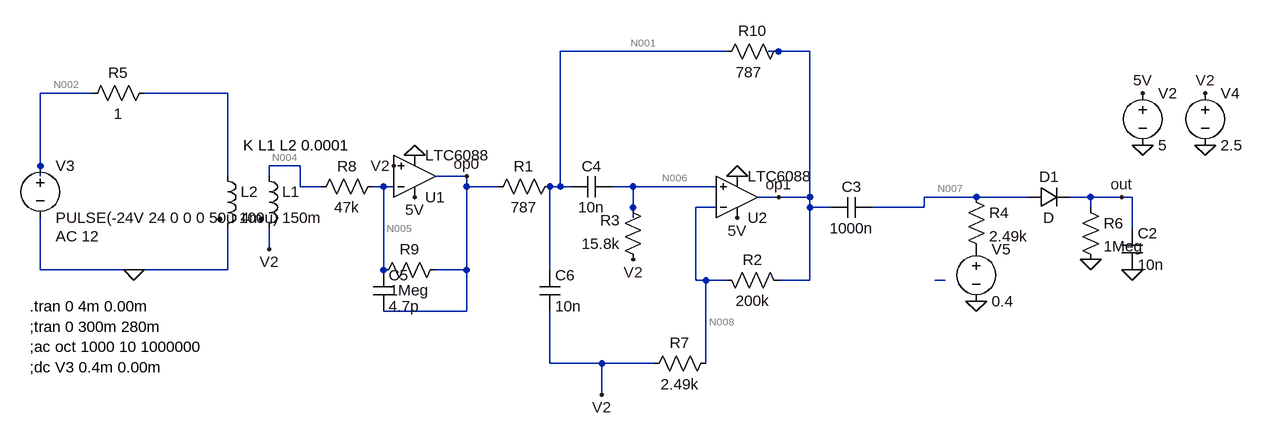
[diagram p0: schematic pw_ti.asc]
* pw_ti.asc
L1 N004 V2 150m
R1 N001 op0 787
V3 N002 0 PULSE(-24V 24 0 0 0 50u 100u) AC 12
R2 op1 N008 200k
* U2: LTC6088 (symbol Opamps\LTC6088 not available, pins judged from their places): In+=N006 In-=N008 V+=5V V-=0 OUT=op1
V2 5V 0 5
V4 V2 0 2.5
D1 N007 out D
C2 out 0 10n
R6 out 0 1Meg
C3 N007 op1 1000n
C4 N006 N001 10n
R3 V2 N006 15.8k
R7 N008 V2 2.49k
R4 N007 P001 2.49k
V5 P001 0 0.4
L2 N003 0 4m
R5 N003 N002 1
* U1: LTC6088 (symbol Opamps\LTC6088 not available, pins judged from their places): In+=V2 In-=N005 V+=5V V-=0 OUT=op0
R8 N005 N004 47k
R9 op0 N005 1Meg
C5 N005 op0 4.7p
C6 N001 V2 10n
R10 op1 N001 787
.model D D
.lib standard.dio
.tran 0 4m 0.00m
;tran 0 300m 280m
;ac oct 1000 10 1000000
;dc V3 0.4m 0.00m
K L1 L2 0.0001
.backanno
.end

* Results of the author's LTspice run, read from the files saved beside the schematic
* Operating Point, zero values left out:
*   V(n004) = 2.5 V
*   V(v2) = 2.5 V
*   V(n001) = 2.5 V
*   V(op0) = 2.5 V
*   V(n002) = -24 V
*   V(op1) = 2.5 V
*   V(n008) = 2.5 V
*   V(5v) = 5 V
*   V(n006) = 2.5 V
*   V(n007) = 399.9 mV
*   V(out) = 22.1 mV
*   V(p001) = 400 mV
*   V(n005) = 2.5 V
*   I(D1) = 22.1 nA
*   I(L2) = -24 A
*   I(L1) = 9.631 pA
*   I(R10) = 12.34 nA
*   I(R9) = 13.13 pA
*   I(R8) = 9.631 pA
*   I(R5) = 24 A
*   I(R4) = -22.1 nA
*   I(R7) = 159.6 pA
*   I(R3) = 3.5 pA
*   I(R6) = 22.1 nA
*   I(R2) = 163.1 pA
*   I(R1) = 12.34 nA
*   I(V5) = -22.1 nA
*   I(V4) = 162.2 pA
*   I(V2) = -2.098 mA
*   I(V3) = 24 A
*   Ix(u2:1) = 3.5 pA
*   Ix(u2:2) = 3.5 pA
*   Ix(u2:3) = 1.049 mA
*   Ix(u2:4) = -1.049 mA
*   Ix(u2:5) = -12.51 nA
*   Ix(u1:1) = 3.5 pA
*   Ix(u1:2) = 3.5 pA
*   Ix(u1:3) = 1.049 mA
*   Ix(u1:4) = -1.049 mA
*   Ix(u1:5) = 12.33 nA
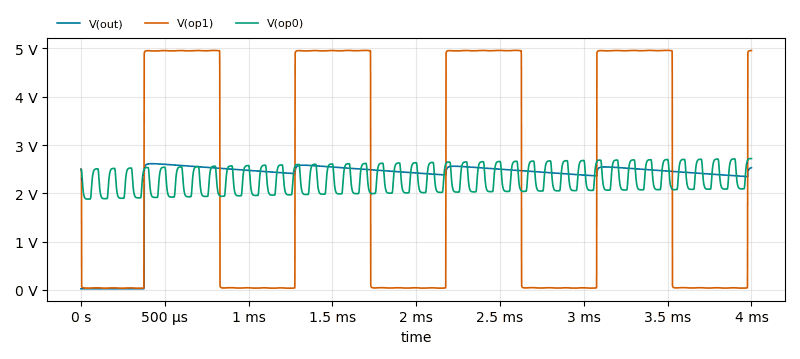
[diagram p1: Transient Analysis of pw_ti.asc, plotted from the saved traces]
* Transient Analysis, 1 run:
*   V(out): min 21.29 mV, max 2.614 V, average 2.249 V, rms 2.361 V, last 2.53 V
*   V(op1): min 33.09 mV, max 4.961 V, average 2.289 V, rms 3.349 V, last 4.957 V
*   V(op0): min 1.88 V, max 2.719 V, average 2.283 V, rms 2.3 V, last 2.718 V